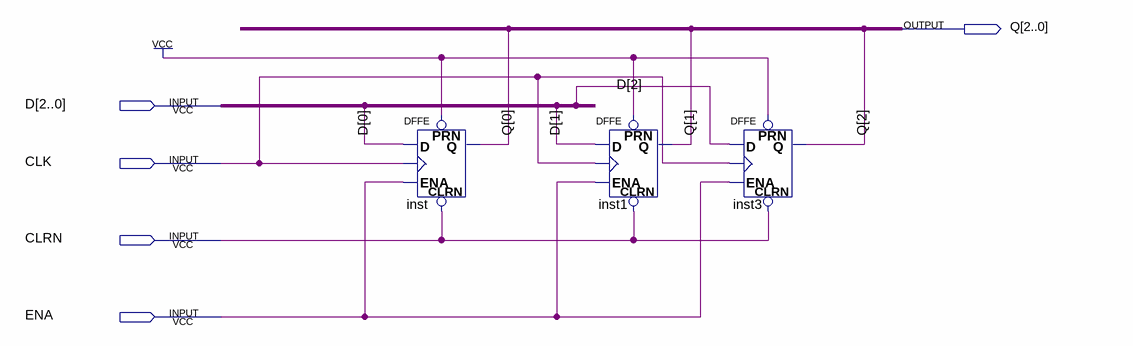
[diagram p0: schematic sheet]
// Quartus schematic REGISTRADOR3bits.bdf as structural Verilog: 3 symbols, 5 pins
module REGISTRADOR3bits (
  input  [2:0] D,
  input  CLK,
  input  CLRN,
  input  ENA,
  output [2:0] Q
);

  DFFE inst (.PRN(1'b1), .CLRN(CLRN), .D(D[0]), .CLK(CLK), .ENA(ENA), .Q(Q[0]));
  DFFE inst1 (.PRN(1'b1), .CLRN(CLRN), .D(D[1]), .CLK(CLK), .ENA(ENA), .Q(Q[1]));
  DFFE inst3 (.PRN(1'b1), .CLRN(CLRN), .D(D[2]), .CLK(CLK), .ENA(ENA), .Q(Q[2]));
endmodule
